# EAGLE design 7 Channel Mixer (EAGLE 9.6.2)
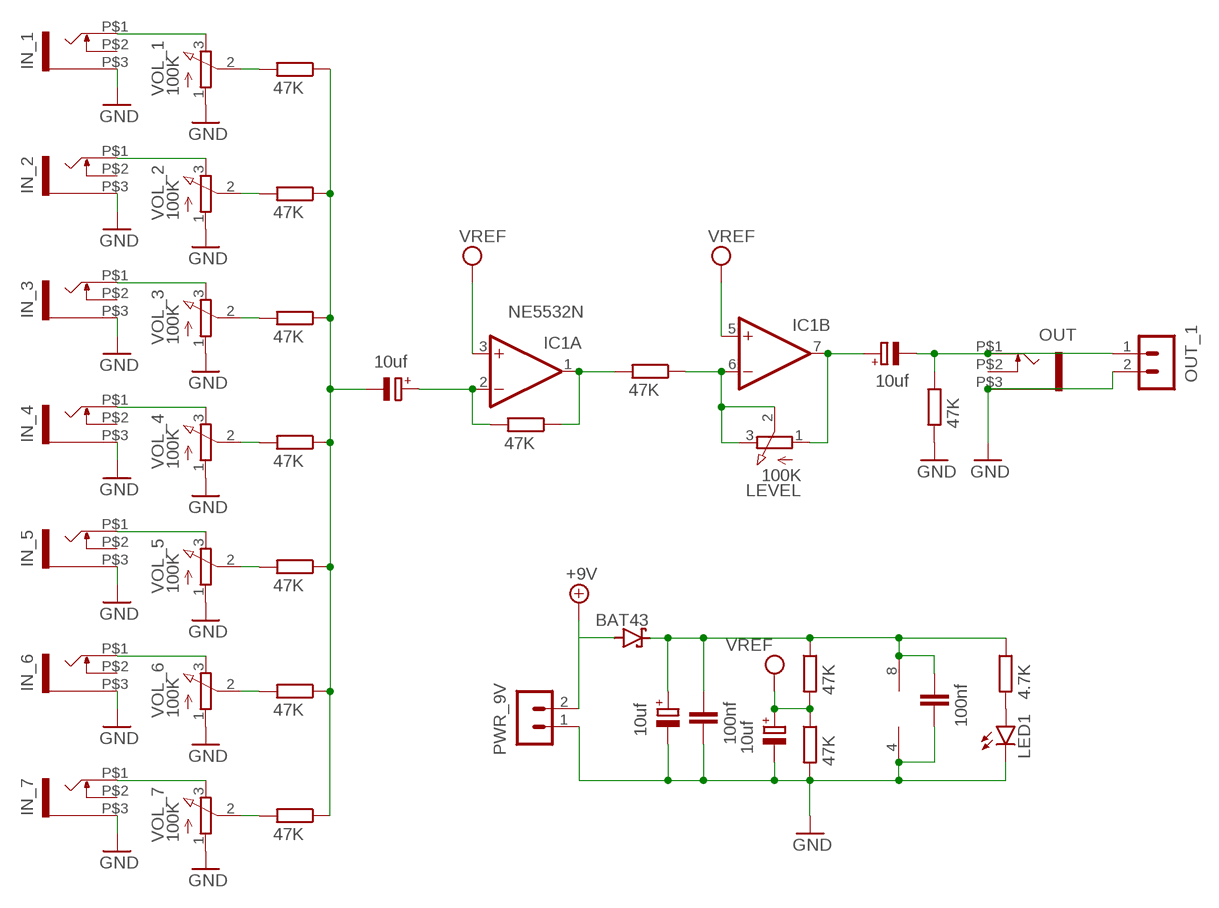
[diagram p0: schematic, sheet 1]

## Parts
C1  10uf  CPOL-EUE2,5-6E  [E2,5-6E]
C2  10uf  CPOL-EUE2,5-6E  [E2,5-6E]
C3  10uf  CPOL-EUE2,5-6E  [E2,5-6E]
C4  10uf  CPOL-EUE2,5-6E  [E2,5-6E]
C5  100nf  C-EU050-024X044  [C050-024X044]
C6  100nf  C-EU050-024X044  [C050-024X044]
D4  BAT43  BAT42  [DO35-10]
IC1  NE5532N  [DIL08]
IN_1  WQP-PJ301M-12_JACK  [WQP-PJ301M-12_JACK]
IN_2  WQP-PJ301M-12_JACK  [WQP-PJ301M-12_JACK]
IN_3  WQP-PJ301M-12_JACK  [WQP-PJ301M-12_JACK]
IN_4  WQP-PJ301M-12_JACK  [WQP-PJ301M-12_JACK]
IN_5  WQP-PJ301M-12_JACK  [WQP-PJ301M-12_JACK]
IN_6  WQP-PJ301M-12_JACK  [WQP-PJ301M-12_JACK]
IN_7  WQP-PJ301M-12_JACK  [WQP-PJ301M-12_JACK]
LED1  LED3MM  [LED3MM]
LEVEL  100K  EVUF2M  [EVUFXM]
OUT  WQP-PJ301M-12_JACK  [WQP-PJ301M-12_JACK]
OUT_1  B2B-PH-K-S  [B2B-PH-K-S]
PWR_9V  B2B-PH-K-S  [B2B-PH-K-S]
R1  47K  R-EU_0204/7  [0204/7]
R2  47K  R-EU_0204/7  [0204/7]
R3  47K  R-EU_0204/7  [0204/7]
R4  47K  R-EU_0204/7  [0204/7]
R5  47K  R-EU_0204/7  [0204/7]
R6  47K  R-EU_0204/7  [0204/7]
R7  47K  R-EU_0204/7  [0204/7]
R8  47K  R-EU_0204/7  [0204/7]
R9  47K  R-EU_0204/7  [0204/7]
R10  47K  R-EU_0204/7  [0204/7]
R11  47K  R-EU_0204/7  [0204/7]
R12  4.7K  R-EU_0204/7  [0204/7]
R13  47K  R-EU_0204/7  [0204/7]
VOL_1  100K  EVUF2M  [EVUFXM]
VOL_2  100K  EVUF2M  [EVUFXM]
VOL_3  100K  EVUF2M  [EVUFXM]
VOL_4  100K  EVUF2M  [EVUFXM]
VOL_5  100K  EVUF2M  [EVUFXM]
VOL_6  100K  EVUF2M  [EVUFXM]
VOL_7  100K  EVUF2M  [EVUFXM]

## Nets
+9V: D4.A PWR_9V.2
GND: C3.- C4.- C5.1 C6.1 IC1.4(P:V-) IN_1.P$3 IN_2.P$3 IN_3.P$3 IN_4.P$3 IN_5.P$3 IN_6.P$3 IN_7.P$3 LED1.K(C) OUT.P$3 OUT_1.2 PWR_9V.1 R9.2 R11.2 VOL_1.1(A) VOL_2.1(A) VOL_3.1(A) VOL_4.1(A) VOL_5.1(A) VOL_6.1(A) VOL_7.1(A)
N$1: IN_7.P$1 VOL_7.3(E)
N$2: R1.2 VOL_2.2(S)
N$3: IN_5.P$1 VOL_5.3(E)
N$4: R2.2 VOL_3.2(S)
N$5: IN_6.P$1 VOL_6.3(E)
N$6: R3.2 VOL_4.2(S)
N$7: IN_3.P$1 VOL_3.3(E)
N$8: R5.2 VOL_1.2(S)
N$9: R4.2 VOL_5.2(S)
N$10: IN_4.P$1 VOL_4.3(E)
N$11: R6.2 VOL_6.2(S)
N$12: C1.- R1.1 R2.1 R3.1 R4.1 R5.1 R6.1 R13.1
N$13: C2.- OUT.P$1 OUT_1.1 R9.1
N$14: C1.+ IC1.2(A:-IN) R7.2
N$15: IN_2.P$1 VOL_2.3(E)
N$16: IC1.1(A:OUT) R7.1 R8.2
N$17: IC1.6(B:-IN) LEVEL.2(S) LEVEL.3(E) R8.1
N$18: C2.+ IC1.7(B:OUT) LEVEL.1(A)
N$20: LED1.A R12.2
N$21: C4.+ C5.2 C6.2 D4.C IC1.8(P:V+) R10.1 R12.1
N$22: IN_1.P$1 VOL_1.3(E)
N$23: R13.2 VOL_7.2(S)
VCC: C3.+ IC1.3(A:+IN) IC1.5(B:+IN) R10.2 R11.1 ; supply symbol labelled VREF
Unconnected: IN_1.P$2 IN_2.P$2 IN_3.P$2 IN_4.P$2 IN_5.P$2 IN_6.P$2 IN_7.P$2 OUT.P$2

## Library data of the parts
C1-C4 = rcl:CPOL-EU: POLARIZED CAPACITOR, European symbol; SPICEPREFIX: C
C5 C6 = rcl:C-EU: CAPACITOR, European symbol; SPICEPREFIX: C
D4 = diode:BAT42: DIODE barrier diode
IC1 = linear4:NE5532: AUDIO AMPLIFIER
IN_1-IN_7 OUT = thonkiconn:WQP-PJ301M-12_JACK
LED1 = led:LED: LED OSRAM: - CHIPLED LG R971, LG N971, LY N971, LG Q971, LY Q971, LO R971, LY R971 LH N974, LH R974 LS Q976, LO Q976, LY Q976 LO Q996 - Hyper CHIPLED LW Q18S LB Q993, LB Q99A, LB R99A - SideLED LS A670, LO A670, LY A670, LG A670, LP A670 LB A673, LV A673, LT A673, LW A673 LH A674 LY A675 LS A676, LA A676, LO A676, LY A676, LW A676 LS A679, LY A679, LG A679 - Hyper Micro SIDELED® LS Y876, LA Y876, LO Y876, LY Y876 LT Y87S - SmartLED LW L88C, LW L88S LB L89C, LB L89S, LG L890 LS L89K, LO L89K, LY L89K LS L896, LA L896, LO L896, LY L896 - TOPLED LS T670, LO T670, LY T670, LG T670, LP T670 LSG T670, LSP T670, LSY T670, LOP T670, LYG T670 LG T671, LOG T671, LSG T671 LB T673, LV T673, LT T673, LW T673 LH T674 LS T676, LA T676, LO T676, LY T676, LB T676, LH T676, LSB T676, LW T676 LB T67C, LV T67C, LT T67C, LS T67K, LO T67K, LY T67K, LW E67C LS E67B, LA E67B, LO E67B, LY E67B, LB E67C, LV E67C, LT E67C LW T67C LS T679, LY T679, LG T679 LS T770, LO T770, LY T770, LG T770, LP T770 LB T773, LV T773, LT T773, LW T773 LH T774 LS E675, LA E675, LY E675, LS T675 LS T776, LA T776, LO T776, LY T776, LB T776 LHGB T686 LT T68C, LB T68C - Hyper Mini TOPLED® LB M676 - Mini TOPLED Santana® LG M470 LS M47K, LO M47K, LY M47K Source: http://www.osram.convergy.de LUXEON: - LUMILED® LXK2-PW12-R00, LXK2-PW12-S00, LXK2-PW14-U00, LXK2-PW14-V00 LXK2-PM12-R00, LXK2-PM12-S00, LXK2-PM14-U00 LXK2-PE12-Q00, LXK2-PE12-R00, LXK2-PE12-S00, LXK2-PE14-T00, LXK2-PE14-U00 LXK2-PB12-K00, LXK2-PB12-L00, LXK2-PB12-M00, LXK2-PB14-N00, LXK2-PB14-P00, LXK2-PB14-Q00 LXK2-PR12-L00, LXK2-PR12-M00, LXK2-PR14-Q00, LXK2-PR14-R00 LXK2-PD12-Q00, LXK2-PD12-R00, LXK2-PD12-S00 LXK2-PH12-R00, LXK2-PH12-S00 LXK2-PL12-P00, LXK2-PL12-Q00, LXK2-PL12-R00 Source: www.luxeon.com KINGBRIGHT: KA-3528ASYC Source: www.kingbright.com
LEVEL VOL_1-VOL_7 = pot:EVU: 9 mm Square Rotary Potentiometers Source: Panasonic
OUT_1 PWR_9V = con-JST PH:B2B-PH: JST PH series header 2.00mm pitch disconnectable crimp style connectors, vertical (side entry type), 2 pins
R1-R13 = rcl:R-EU_: RESISTOR, European symbol; SPICEPREFIX: R

## Board
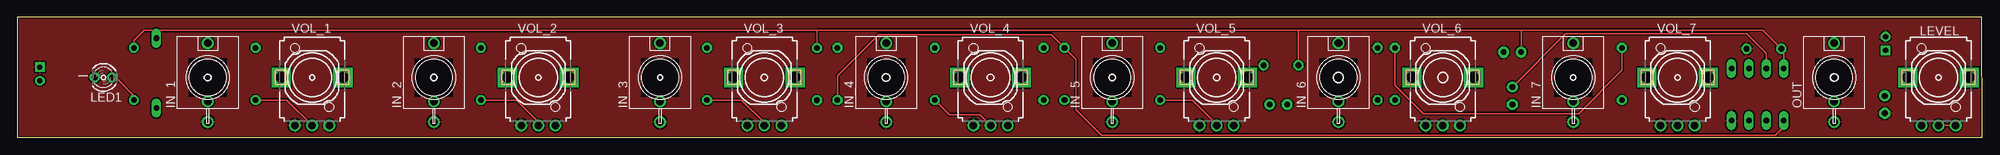
[diagram p1: board, top side]
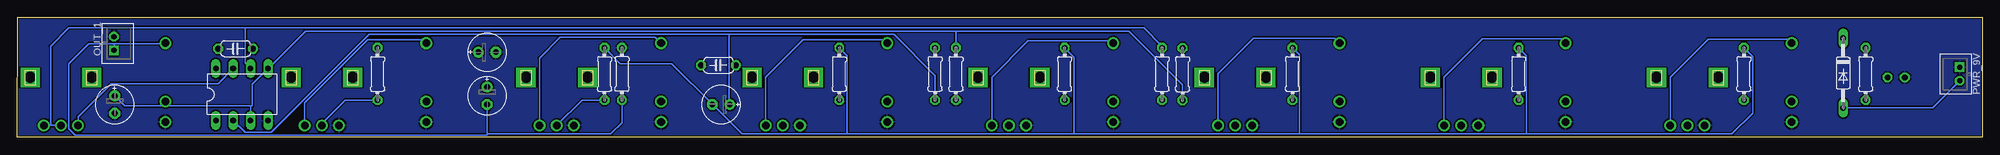
[diagram p2: board, bottom side, seen from below]

Size 286.97 x 17.57 mm. Coordinates in mm from the lower left corner, seen from the top.
Outline: 0.03,0 286.97,0 286.87,17.57 0,17.54 0.03,0
Copper layers (1*16): Top 0.035mm / dielectric 1.5mm / Bottom 0.035mm
Design rules "SparkFun": minimum track width 8mil, minimum drill 20mil, track to track 8mil, track to pad 8mil, pad to pad 8mil, via to via 8mil, smd to smd 8mil, copper to edge 8mil, drill to drill 8mil, minimum pad ring 12mil, minimum via ring 10mil, stop-mask expansion 4mil, vias tented up to drill 20mil, thermal gap 10mil

### Footprints (pad centres in the part's own frame; a part is rotated, then mirrored left to right if it is on the bottom)
E2,5-6E = drill 0.813 pad 1.575: + -1.27,0 | drill 0.813 pad 1.575 octagon: - 1.27,0
C050-024X044 = drill 0.813 octagon: 1 -2.54,0; 2 2.54,0
DO35-10 = drill 0.813 long: A 5.08,0; C -5.08,0
DIL08 = drill 0.813 long: 1 -3.81,-3.81; 2 -1.27,-3.81; 3 1.27,-3.81; 4 3.81,-3.81; 5 3.81,3.81; 6 1.27,3.81; 7 -1.27,3.81; 8 -3.81,3.81
WQP-PJ301M-12_JACK = drill 1.1: P$1 0,5; P$2 0,-3.5; P$3 0,-6.5
LED3MM = drill 0.813 octagon: A -1.27,0; K 1.27,0
EVUFXM = drill 1.1 pad 1.676: 1 -2.5,-7; 2 0,-7; 3 2.5,-7 | drill 1.6 pad 2.8 square: M1 4.5,0; M2 -4.5,0
B2B-PH-K-S = drill 0.75 pad 1.3 square: 1 1,0 | drill 0.75 pad 1.3 octagon: 2 -1,0
0204/7 = drill 0.813 octagon: 1 -3.81,0; 2 3.81,0

### Placement (x,y rotation side)
C1  184.18,4.83 180 bottom
C2  218.34,6.1 270 bottom
C3  272.72,4.8 270 bottom
C4  218.34,12.45 0 bottom
C5  184.56,10.54 180 bottom
C6  255.07,12.95 180 bottom
D4  20.35,9.4 270 bottom
IC1  254.15,6.27 0 bottom
IN_1  27.84,8.76 0 top
IN_2  60.86,8.76 0 top
IN_3  93.88,8.76 0 top
IN_4  126.9,8.76 0 top
IN_5  159.92,8.76 0 top
IN_6  192.94,8.76 0 top
IN_7  227.23,8.76 0 top
LED1  12.6,8.76 180 top
LEVEL  280.57,8.76 0 top
OUT  265.33,8.76 0 top
OUT_1  272.82,13.72 270 bottom
PWR_9V  3.33,9.27 90 bottom
R1  67.72,9.27 270 bottom
R2  100.74,9.27 270 bottom
R3  134.01,9.27 270 bottom
R4  166.9,9.27 270 bottom
R5  34.82,9.27 270 bottom
R6  201.19,9.27 270 bottom
R7  152.93,9.27 270 bottom
R8  119.79,9.27 270 bottom
R9  198.65,9.27 90 bottom
R10  116.79,9.25 270 bottom
R11  149.89,9.27 270 bottom
R12  17.04,9.27 270 bottom
R13  234.34,9.27 270 bottom
VOL_1  43.08,8.76 0 top
VOL_2  76.1,8.76 0 top
VOL_3  109.12,8.76 0 top
VOL_4  142.14,8.76 0 top
VOL_5  175.16,8.76 0 top
VOL_6  208.18,8.76 0 top
VOL_7  242.47,8.76 0 top

### Tracks (layer width: path | path; a pad name or v marks a point on that pad's centre or on a via)
+9V
  Bottom 0.203: PWR_9V.2 7.28,4.32 D4.A
GND
  pour Top: -0.1,17.65 286.92,17.65 286.92,-0.13 0.15,-0.13 -0.1,-0.13
  pour Bottom: -0.1,17.65 -0.1,-0.13 286.92,-0.13 286.92,17.65
N$1
  Bottom 0.203: IN_7.P$1 227.74,14.27 235.76,14.27 244.97,5.07 VOL_7.3
N$2
  Top 0.203: R1.2 72.92,5.46 76.1,2.29 VOL_2.2
N$3
  Bottom 0.203: IN_5.P$1 160.43,14.27 172.19,14.27 177.66,8.8 VOL_5.3
N$4
  Top 0.203: R2.2 105.82,5.46 109.12,2.16 VOL_3.2
N$5
  Bottom 0.203: IN_6.P$1 193.78,14.6 207.67,14.6 210.68,11.6 VOL_6.3
N$6
  Top 0.203: R3.2 136.17,3.3 140.6,3.3 VOL_4.2
N$7
  Bottom 0.203: IN_3.P$1 94.59,14.48 106.45,14.48 111.62,9.31 VOL_3.3
N$8
  Top 0.203: VOL_1.2 39.38,5.46 R5.2
N$9
  Top 0.203: R4.2 171.6,5.46 175.16,1.91 VOL_5.2
N$10
  Bottom 0.203: IN_4.P$1 127.23,14.1 139.34,14.1 144.64,8.8 VOL_4.3
N$11
  Bottom 0.203: VOL_6.2 204.48,5.46 R6.2
N$12
  Top 0.203: R13.1 234.34,9.78 228.05,3.49 205.32,3.49 201.19,7.62 R6.1
  Bottom 0.203: 165.76,0.51 181.13,0.51 C1.- 191.41,10.79 198.91,10.79 R6.1 | 165.76,0.51 132.61,0.51 | 132.61,0.51 99.72,0.51 | 99.72,0.51 66.57,0.51 | 66.57,0.51 36.6,0.51 33.55,3.56 33.55,11.81 R5.1 | R1.1 66.57,11.94 66.57,0.51 | R4.1 165.76,11.94 165.76,0.51 | R3.1 132.61,11.68 132.61,0.51 | R2.1 99.72,12.06 99.72,0.51
N$13
  Bottom 0.203: 272.82,13.72 OUT_1.1 | 272.82,13.72 265.38,13.72 OUT.P$1 | C2.- 218.34,0.51 | 218.34,0.51 218.34,0.31 278.46,0.31 279.41,1.25 279.41,2.24 279.43,2.26 279.43,10.79 276.5,13.72 272.82,13.72 | 218.34,0.51 200.3,0.51 198.65,2.16 R9.1
N$14
  Bottom 0.203: 183.03,15.04 234.75,15.04 235.46,15.04 235.57,15.04 249.88,0.72 253.68,0.72 IC1.2 | 183.03,15.04 158.95,15.04 152.93,9.02 R7.2 | C1.+ 183.03,4.95 183.03,15.04
N$15
  Bottom 0.203: IN_2.P$1 61.5,14.4 73,14.4 78.6,8.8 VOL_2.3
N$16
  Top 0.203: R8.2 119.79,9.02 125.76,14.99 151.03,14.99 R7.1 154.58,11.43 154.58,4.06 158.34,0.31 256.72,0.31 257.96,1.55 IC1.1
N$17
  Top 0.203: LEVEL.2 LEVEL.3
  Bottom 0.203: LEVEL.3 280.58,1.76 280.57,1.78 LEVEL.2 282.09,1.76 282.09,13.33 279.43,16 253.7,16 | R8.1 119.79,13.33 122.45,16 253.7,16 | IC1.6 253.7,10.9 253.7,16
N$18
  Top 0.203: IC1.7 255.42,12.27 252.58,15.11 226.09,15.11 C2.+
  Bottom 0.203: IC1.7 257.63,7.87 273.23,7.87 278.07,3.03 LEVEL.1
N$20
  Top 0.203: LED1.A 14.38,8.76 17.04,6.1 R12.2
N$21
  Top 0.203: C4.+ 219.63,12.42 219.63,15.62 | 219.63,15.62 254.94,15.62 C6.2 257.96,12.6 IC1.8 | 219.63,15.62 187.1,15.62 | 187.1,15.62 116.79,15.62 | R10.1 116.79,15.62 | 20.35,15.62 116.79,15.62 | R12.1 17.04,14.1 18.57,15.62 20.35,15.62 | D4.C 20.35,15.62 | C5.2 187.1,15.62
N$22
  Bottom 0.203: IN_1.P$1 28.43,14.35 40.03,14.35 45.58,8.8 VOL_1.3
N$23
  Bottom 0.203: R13.2 239.04,5.46 242.47,2.03 VOL_7.2
VCC
  Bottom 0.203: 252.88,4.62 IC1.3 | C3.+ 271.27,4.62 252.88,4.62 | 252.88,4.62 252.63,4.62 252.63,7.8 IC1.5 250.32,10.06 244.86,15.52 149.91,15.52 | R10.2 116.79,7.67 124.64,15.52 149.91,15.52 | R11.1 149.89,15.49 149.91,15.52

### Text on the board
tPlace: _